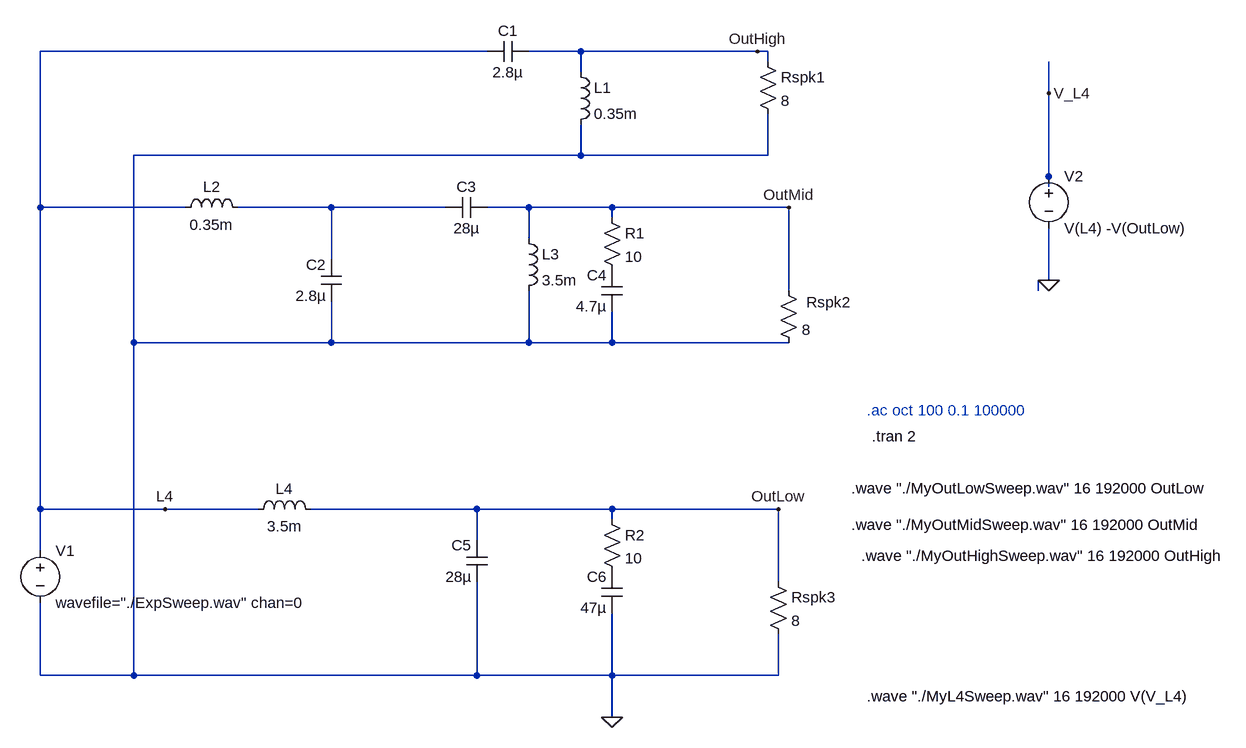
[diagram p0: schematic Draft1.asc]
Draft1.asc, the LTspice schematic file:
Version 4
SHEET 1 2112 976
WIRE 960 -64 272 -64
WIRE 1104 -64 1024 -64
WIRE 1376 -64 1104 -64
WIRE 1392 -64 1376 -64
WIRE 1392 -48 1392 -64
WIRE 1104 -32 1104 -64
WIRE 1824 0 1824 -48
WIRE 1104 96 1104 48
WIRE 1104 96 416 96
WIRE 1392 96 1392 32
WIRE 1392 96 1104 96
WIRE 1824 128 1824 0
WIRE 1824 144 1824 128
WIRE 272 176 272 -64
WIRE 496 176 272 176
WIRE 720 176 576 176
WIRE 896 176 720 176
WIRE 1024 176 960 176
WIRE 1152 176 1024 176
WIRE 1424 176 1152 176
WIRE 1152 192 1152 176
WIRE 1024 224 1024 176
WIRE 720 256 720 176
WIRE 1824 288 1824 208
WIRE 1824 288 1808 288
WIRE 1424 304 1424 176
WIRE 1808 304 1808 288
WIRE 416 384 416 96
WIRE 720 384 720 320
WIRE 720 384 416 384
WIRE 1024 384 1024 304
WIRE 1024 384 720 384
WIRE 1152 384 1152 336
WIRE 1152 384 1024 384
WIRE 1424 384 1152 384
WIRE 272 640 272 176
WIRE 464 640 272 640
WIRE 608 640 464 640
WIRE 944 640 688 640
WIRE 1152 640 944 640
WIRE 1408 640 1152 640
WIRE 1152 656 1152 640
WIRE 944 688 944 640
WIRE 272 704 272 640
WIRE 1408 752 1408 640
WIRE 272 896 272 784
WIRE 416 896 416 384
WIRE 416 896 272 896
WIRE 944 896 944 752
WIRE 944 896 416 896
WIRE 1152 896 1152 800
WIRE 1152 896 944 896
WIRE 1408 896 1408 832
WIRE 1408 896 1152 896
WIRE 1152 960 1152 896
FLAG 1408 640 OutLow
FLAG 1424 176 OutMid
FLAG 1376 -64 OutHigh
FLAG 1152 960 0
FLAG 464 640 L4
FLAG 1824 288 0
FLAG 1824 0 V_L4
SYMBOL res 1136 176 R0
SYMATTR InstName R1
SYMATTR Value 10
SYMBOL res 1136 640 R0
SYMATTR InstName R2
SYMATTR Value 10
SYMBOL res 1376 -64 R0
SYMATTR InstName Rspk1
SYMATTR Value 8
SYMBOL res 1408 288 R0
WINDOW 0 43 34 Left 2
SYMATTR InstName Rspk2
SYMATTR Value 8
SYMBOL res 1392 736 R0
SYMATTR InstName Rspk3
SYMATTR Value 8
SYMBOL Cap 1024 -80 R90
WINDOW 0 0 32 VBottom 2
WINDOW 3 32 32 VTop 2
SYMATTR InstName C1
SYMATTR Value 2.8µ
SYMBOL Cap 736 320 R180
WINDOW 0 24 56 Left 2
WINDOW 3 24 8 Left 2
SYMATTR InstName C2
SYMATTR Value 2.8µ
SYMBOL Cap 896 192 R270
WINDOW 0 32 32 VTop 2
WINDOW 3 0 32 VBottom 2
SYMATTR InstName C3
SYMATTR Value 28µ
SYMBOL Cap 1168 336 R180
WINDOW 0 24 56 Left 2
WINDOW 3 24 8 Left 2
SYMATTR InstName C4
SYMATTR Value 4.7µ
SYMBOL Cap 960 752 R180
WINDOW 0 24 56 Left 2
WINDOW 3 24 8 Left 2
SYMATTR InstName C5
SYMATTR Value 28µ
SYMBOL Cap 1168 800 R180
WINDOW 0 24 56 Left 2
WINDOW 3 24 8 Left 2
SYMATTR InstName C6
SYMATTR Value 47µ
SYMBOL Ind 1088 -48 R0
SYMATTR InstName L1
SYMATTR Value 0.35m
SYMBOL Ind 480 192 R270
WINDOW 0 32 56 VTop 2
WINDOW 3 5 56 VBottom 2
SYMATTR InstName L2
SYMATTR Value 0.35m
SYMBOL Ind 1008 208 R0
SYMATTR InstName L3
SYMATTR Value 3.5m
SYMBOL Ind 592 656 R270
WINDOW 0 32 56 VTop 2
WINDOW 3 5 56 VBottom 2
SYMATTR InstName L4
SYMATTR Value 3.5m
SYMBOL voltage 272 688 R0
SYMATTR InstName V1
SYMATTR Value wavefile="./ExpSweep.wav" chan=0
SYMBOL Voltage 1824 112 R0
SYMATTR InstName V2
SYMATTR Value V(L4) -V(OutLow)
TEXT 1520 608 Left 2 !.wave "./MyOutLowSweep.wav" 16 192000 OutLow
TEXT 1544 488 Left 2 ;.ac oct 100 0.1 100000
TEXT 1552 528 Left 2 !.tran 2
TEXT 1520 664 Left 2 !.wave "./MyOutMidSweep.wav" 16 192000 OutMid
TEXT 1536 712 Left 2 !.wave "./MyOutHighSweep.wav" 16 192000 OutHigh
TEXT 1544 928 Left 2 !.wave "./MyL4Sweep.wav" 16 192000 V(V_L4)

The netlist it stands for:
* Draft1.asc
R1 OutMid P001 10
R2 OutLow P002 10
Rspk1 OutHigh 0 8
Rspk2 OutMid 0 8
Rspk3 OutLow 0 8
C1 OutHigh L4 2.8µ
C2 0 N001 2.8µ
C3 N001 OutMid 28µ
C4 0 P001 4.7µ
C5 0 OutLow 28µ
C6 0 P002 47µ
L1 OutHigh 0 0.35m
L2 L4 N001 0.35m
L3 OutMid 0 3.5m
L4 L4 OutLow 3.5m
V1 L4 0 wavefile="./ExpSweep.wav" chan=0
V2 V_L4 0 V(L4) -V(OutLow)
.wave "./MyOutLowSweep.wav" 16 192000 OutLow
* .ac oct 100 0.1 100000
.tran 2
.wave "./MyOutMidSweep.wav" 16 192000 OutMid
.wave "./MyOutHighSweep.wav" 16 192000 OutHigh
.wave "./MyL4Sweep.wav" 16 192000 V(V_L4)
.backanno
.end